# EAGLE schematic audioamp (EAGLE 6.4)
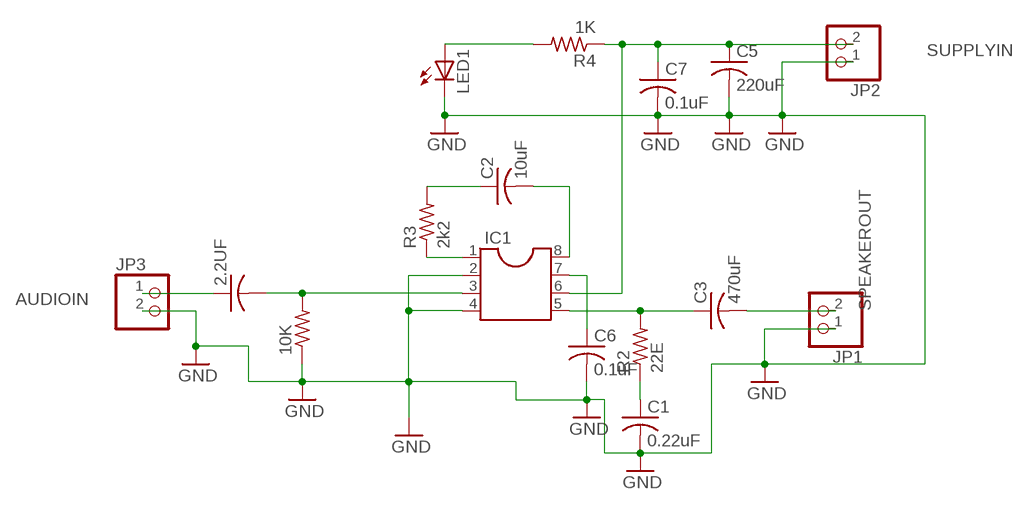
[diagram p0: schematic, sheet 1]

## Parts
2.2UF  C-US025-030X050  [C025-030X050]
10K  R-US_0207/10  [0207/10]
C1  0.22uF  C-US025-030X050  [C025-030X050]
C2  10uF  C-US025-030X050  [C025-030X050]
C3  470uF  C-US025-030X050  [C025-030X050]
C5  220uF  C-US025-030X050  [C025-030X050]
C6  0.1uF  C-US025-030X050  [C025-030X050]
C7  0.1uF  C-US025-030X050  [C025-030X050]
IC1  DIL8  [DIL08]
JP1  PINHD-1X2  [1X02]
JP2  PINHD-1X2  [1X02]
JP3  PINHD-1X2  [1X02]
LED1  LED5MM  [LED5MM]
R2  22E  R-US_0207/10  [0207/10]
R3  2k2  R-US_0207/10  [0207/10]
R4  1K  R-US_0207/10  [0207/10]

## Nets
AUDIOIN: 2.2UF.1 JP3.1
GND: 10K.1 C1.2 C5.2 C6.2 C7.2 IC1.2 IC1.4 JP1.1 JP2.1 JP3.2 LED1.K(C)
N$1: C2.1 R3.2
N$2: IC1.1 R3.1
N$3: C2.2 IC1.8
N$5: C3.1 IC1.5 R2.2
N$6: C1.1 R2.1
N$7: C6.1 IC1.7
N$9: 2.2UF.2 10K.2 IC1.3
N$14: LED1.A R4.2
SPEAKEROUT: C3.2 JP1.2
SUPPLYIN: C5.1 C7.1 IC1.6 JP2.2 R4.1

## Library data of the parts
2.2UF C1-C3 C5-C7 = rcl:C-US: CAPACITOR, American symbol
10K R2-R4 = resistor:R-US_: RESISTOR, American symbol
IC1 = ic-package:DIL8: Dual In Line / Socket
JP1-JP3 = pinhead:PINHD-1X2: PIN HEADER
LED1 = CEDTv68:LED